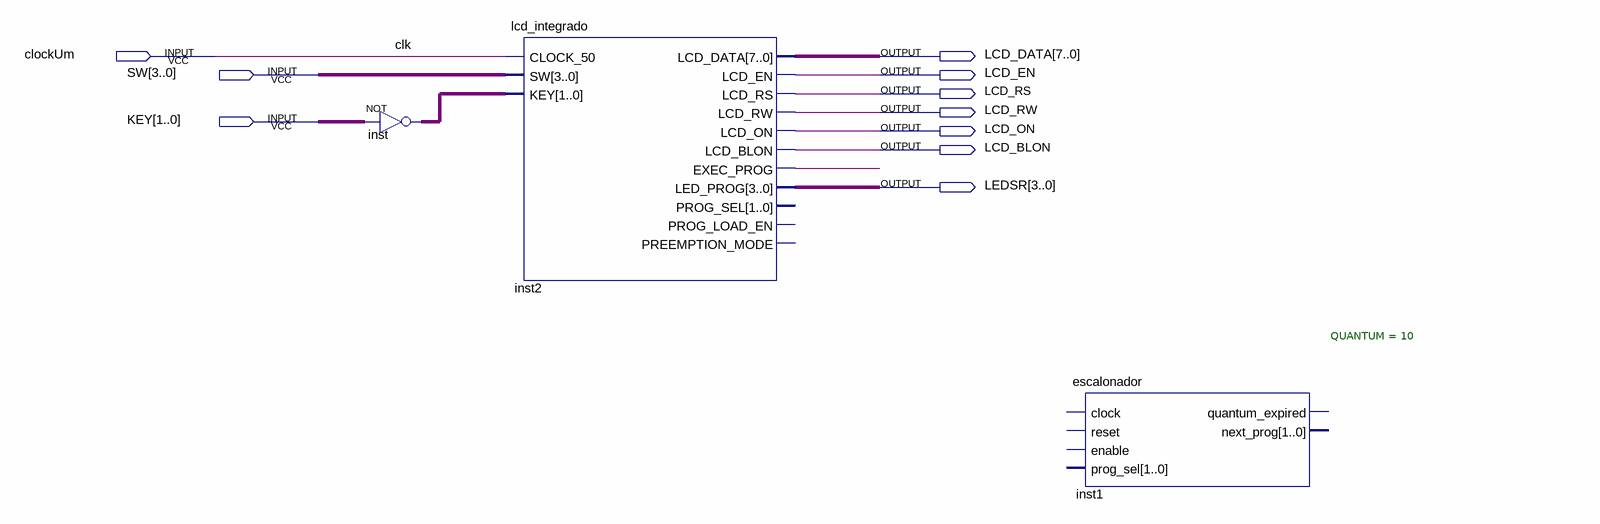
[diagram p0: schematic sheet]
// Quartus schematic TesteLCDPreemptivo.bdf as structural Verilog: 3 symbols, 10 pins
module TesteLCDPreemptivo (
  input  clockUm,
  input  [3:0] SW,
  input  [1:0] KEY,
  output [7:0] LCD_DATA,
  output LCD_EN,
  output LCD_RS,
  output LCD_RW,
  output LCD_ON,
  output LCD_BLON,
  output [3:0] LEDSR
);

  wire inst2_exec_prog;
  wire [1:0] inst_out;

  assign inst_out = ~KEY;  // NOT inst, 2 bits wide
  lcd_integrado inst2 (
    .CLOCK_50(clockUm), .SW(SW), .KEY(inst_out), .LCD_DATA(LCD_DATA), .LCD_EN(LCD_EN), .LCD_RS(LCD_RS),
    .LCD_RW(LCD_RW), .LCD_ON(LCD_ON), .LCD_BLON(LCD_BLON), .EXEC_PROG(inst2_exec_prog), .LED_PROG(LEDSR));  // open: PROG_SEL, PROG_LOAD_EN, PREEMPTION_MODE
  escalonador #(.QUANTUM(10)) inst1 ();  // open: clock, reset, enable, prog_sel, quantum_expired, next_prog

  // Other names for the same wires on the sheet: clk = clockUm
endmodule
